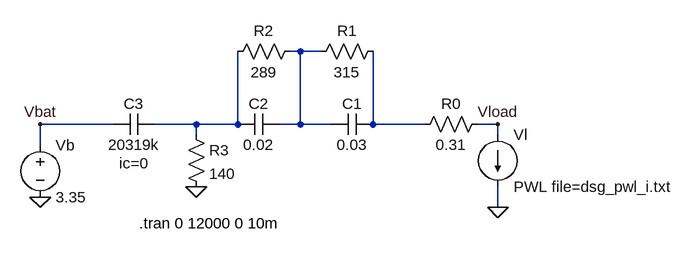
[diagram p0: schematic model.asc]
model.asc, the LTspice schematic file:
Version 4
SHEET 1 1024 680
WIRE 208 32 192 32
WIRE 240 32 208 32
WIRE -80 144 -192 144
WIRE 48 144 -16 144
WIRE 112 144 112 32
WIRE 112 144 48 144
WIRE 208 144 208 32
WIRE 208 144 176 144
WIRE 256 144 208 144
WIRE 320 144 320 32
WIRE 400 144 320 144
WIRE 512 144 480 144
WIRE 48 160 48 144
WIRE 512 160 512 144
WIRE -192 176 -192 144
WIRE 512 272 512 240
FLAG -192 256 0
FLAG -192 144 Vbat
FLAG 512 272 0
FLAG 512 144 Vload
FLAG 48 240 0
SYMBOL voltage -192 160 R0
WINDOW 123 0 0 Left 0
WINDOW 39 0 0 Left 0
SYMATTR InstName Vb
SYMATTR Value 3.35
SYMBOL cap 320 128 R90
WINDOW 0 0 32 VBottom 2
WINDOW 3 32 32 VTop 2
SYMATTR InstName C1
SYMATTR Value 0.03
SYMBOL cap 176 128 R90
WINDOW 0 0 32 VBottom 2
WINDOW 3 32 32 VTop 2
SYMATTR InstName C2
SYMATTR Value 0.02
SYMBOL res 496 128 R90
WINDOW 0 0 56 VBottom 2
WINDOW 3 32 56 VTop 2
SYMATTR InstName R0
SYMATTR Value 0.31
SYMBOL res 336 16 R90
WINDOW 0 0 56 VBottom 2
WINDOW 3 32 56 VTop 2
SYMATTR InstName R1
SYMATTR Value 315
SYMBOL res 208 16 R90
WINDOW 0 0 56 VBottom 2
WINDOW 3 32 56 VTop 2
SYMATTR InstName R2
SYMATTR Value 289
SYMBOL current 512 160 R0
WINDOW 123 0 0 Left 0
WINDOW 39 0 0 Left 0
SYMATTR InstName Vl
SYMATTR Value PWL file=dsg_pwl_i.txt
SYMBOL cap -16 128 R90
WINDOW 0 0 32 VBottom 2
WINDOW 3 32 32 VTop 2
WINDOW 40 60 32 VTop 2
SYMATTR InstName C3
SYMATTR Value 20319k
SYMATTR SpiceLine2 ic=0
SYMBOL res 32 144 R0
SYMATTR InstName R3
SYMATTR Value 140
TEXT -40 296 Left 2 !.tran 0 12000 0 10m

The netlist it stands for:
* model.asc
Vb Vbat 0 3.35
C1 N003 N001 0.03
C2 N001 N002 0.02
R0 Vload N003 0.31
R1 N003 N001 315
R2 N001 N002 289
I§Vl Vload 0 PWL file=dsg_pwl_i.txt
C3 N002 Vbat 20319k ic=0
R3 N002 0 140
.tran 0 12000 0 10m
.backanno
.end